# Altium project NodeCardV2.PrjPcb
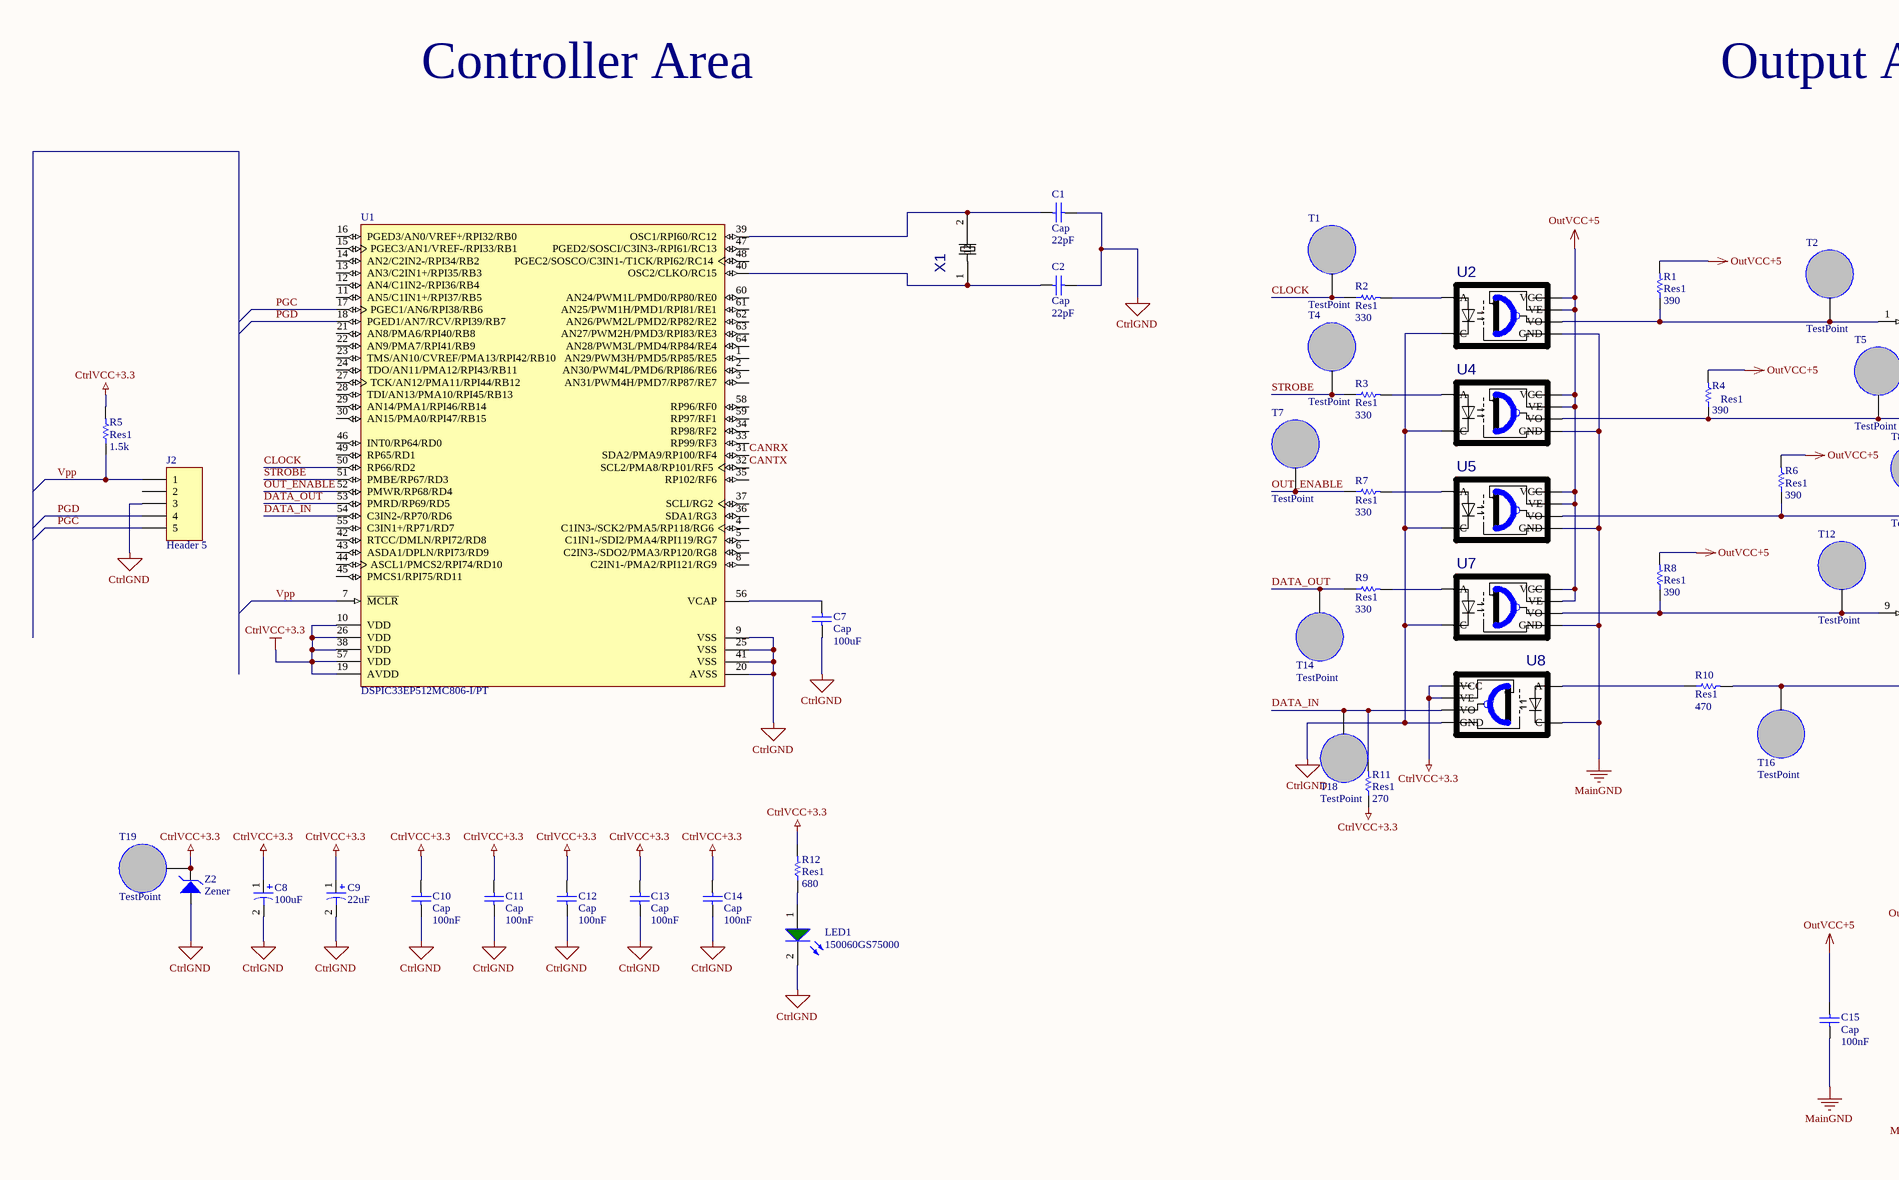
[diagram p0: NodeCardWithCan.SchDoc, top left]
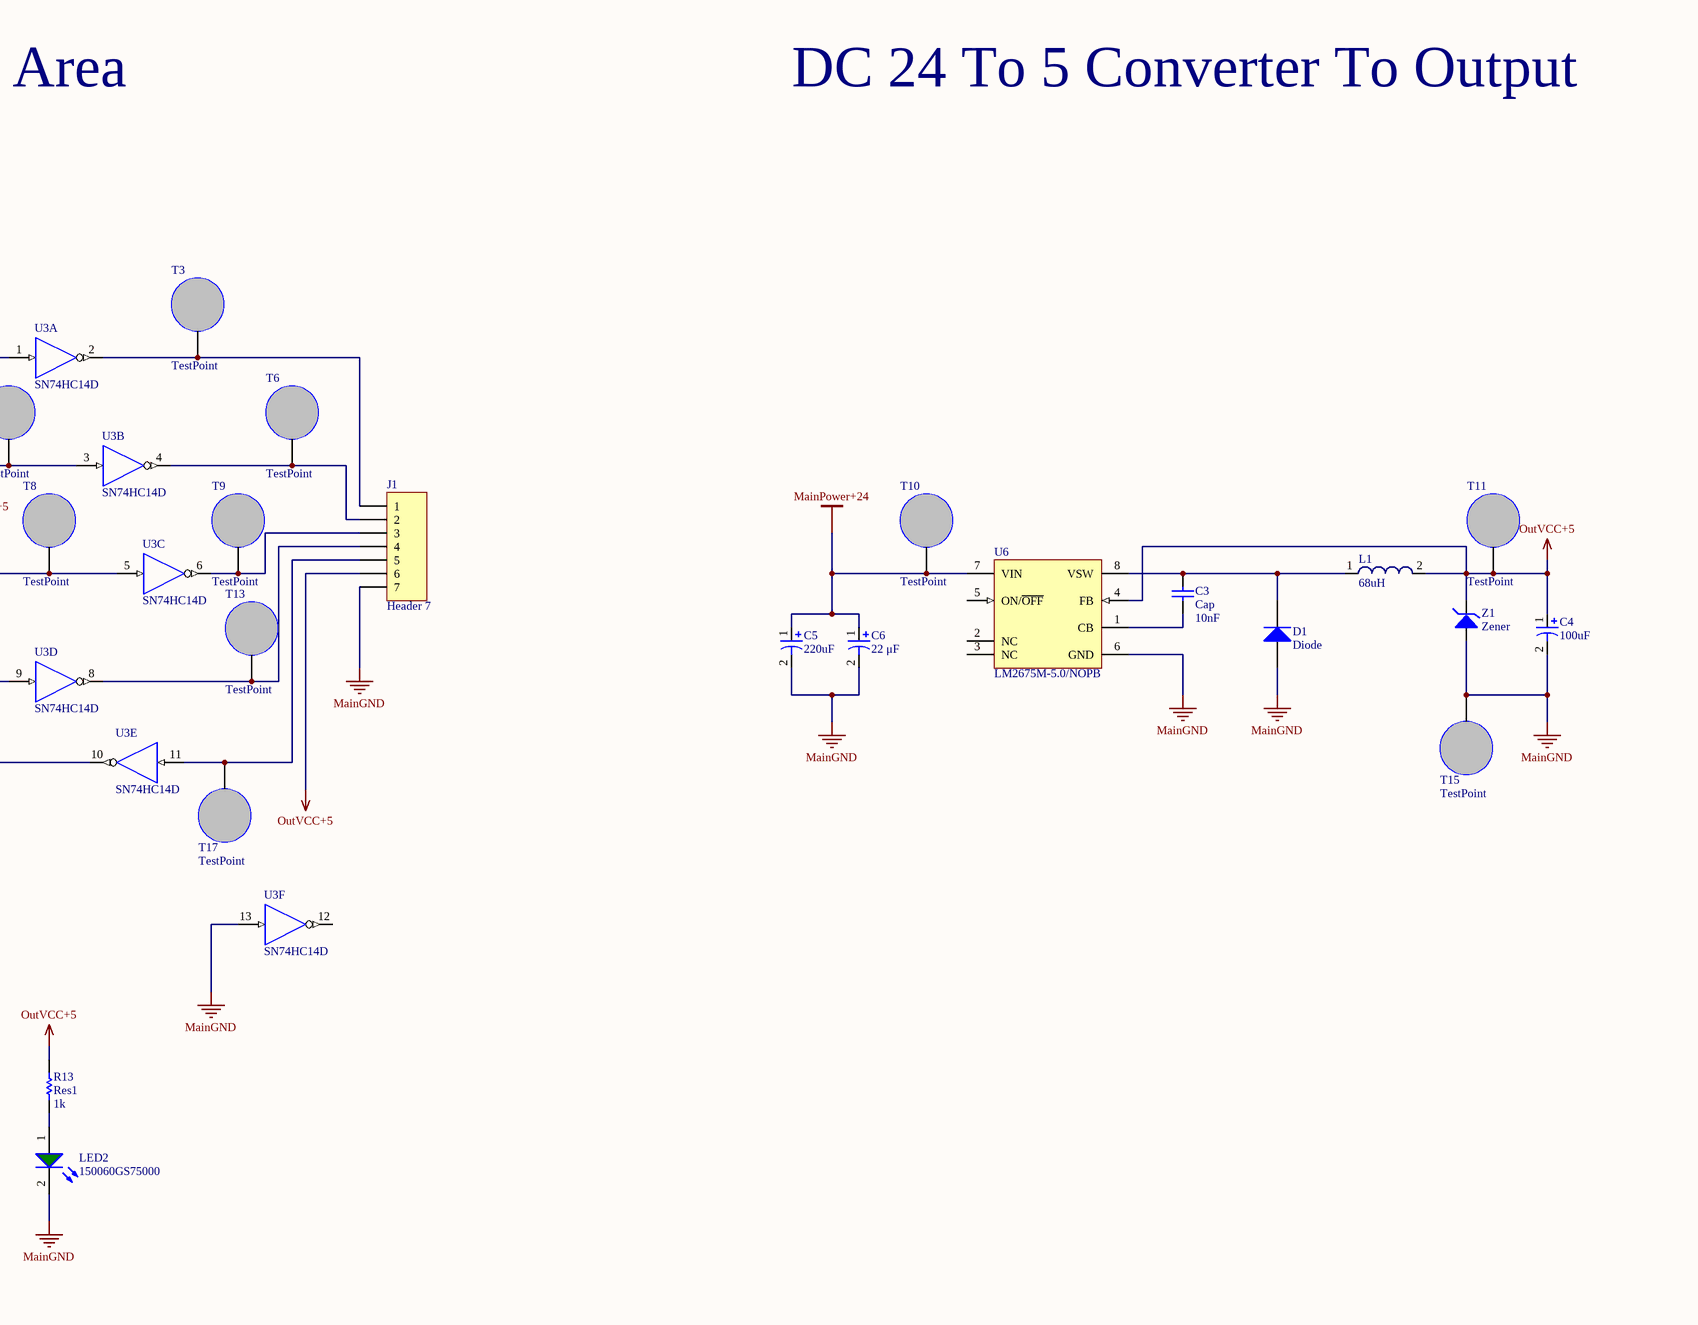
[diagram p1: NodeCardWithCan.SchDoc, top right]
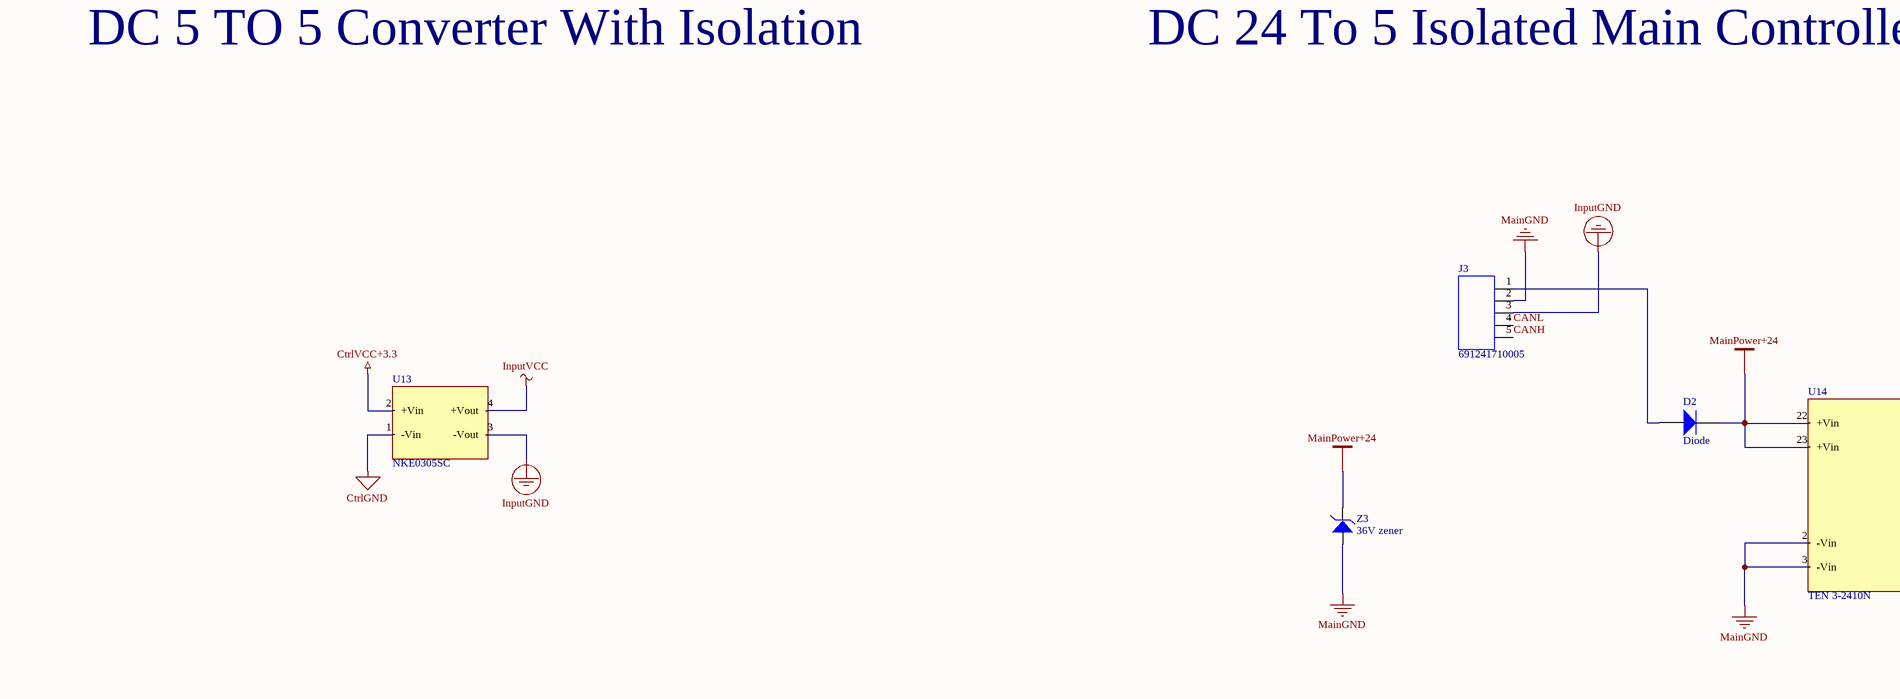
[diagram p2: NodeCardWithCan.SchDoc, bottom left]
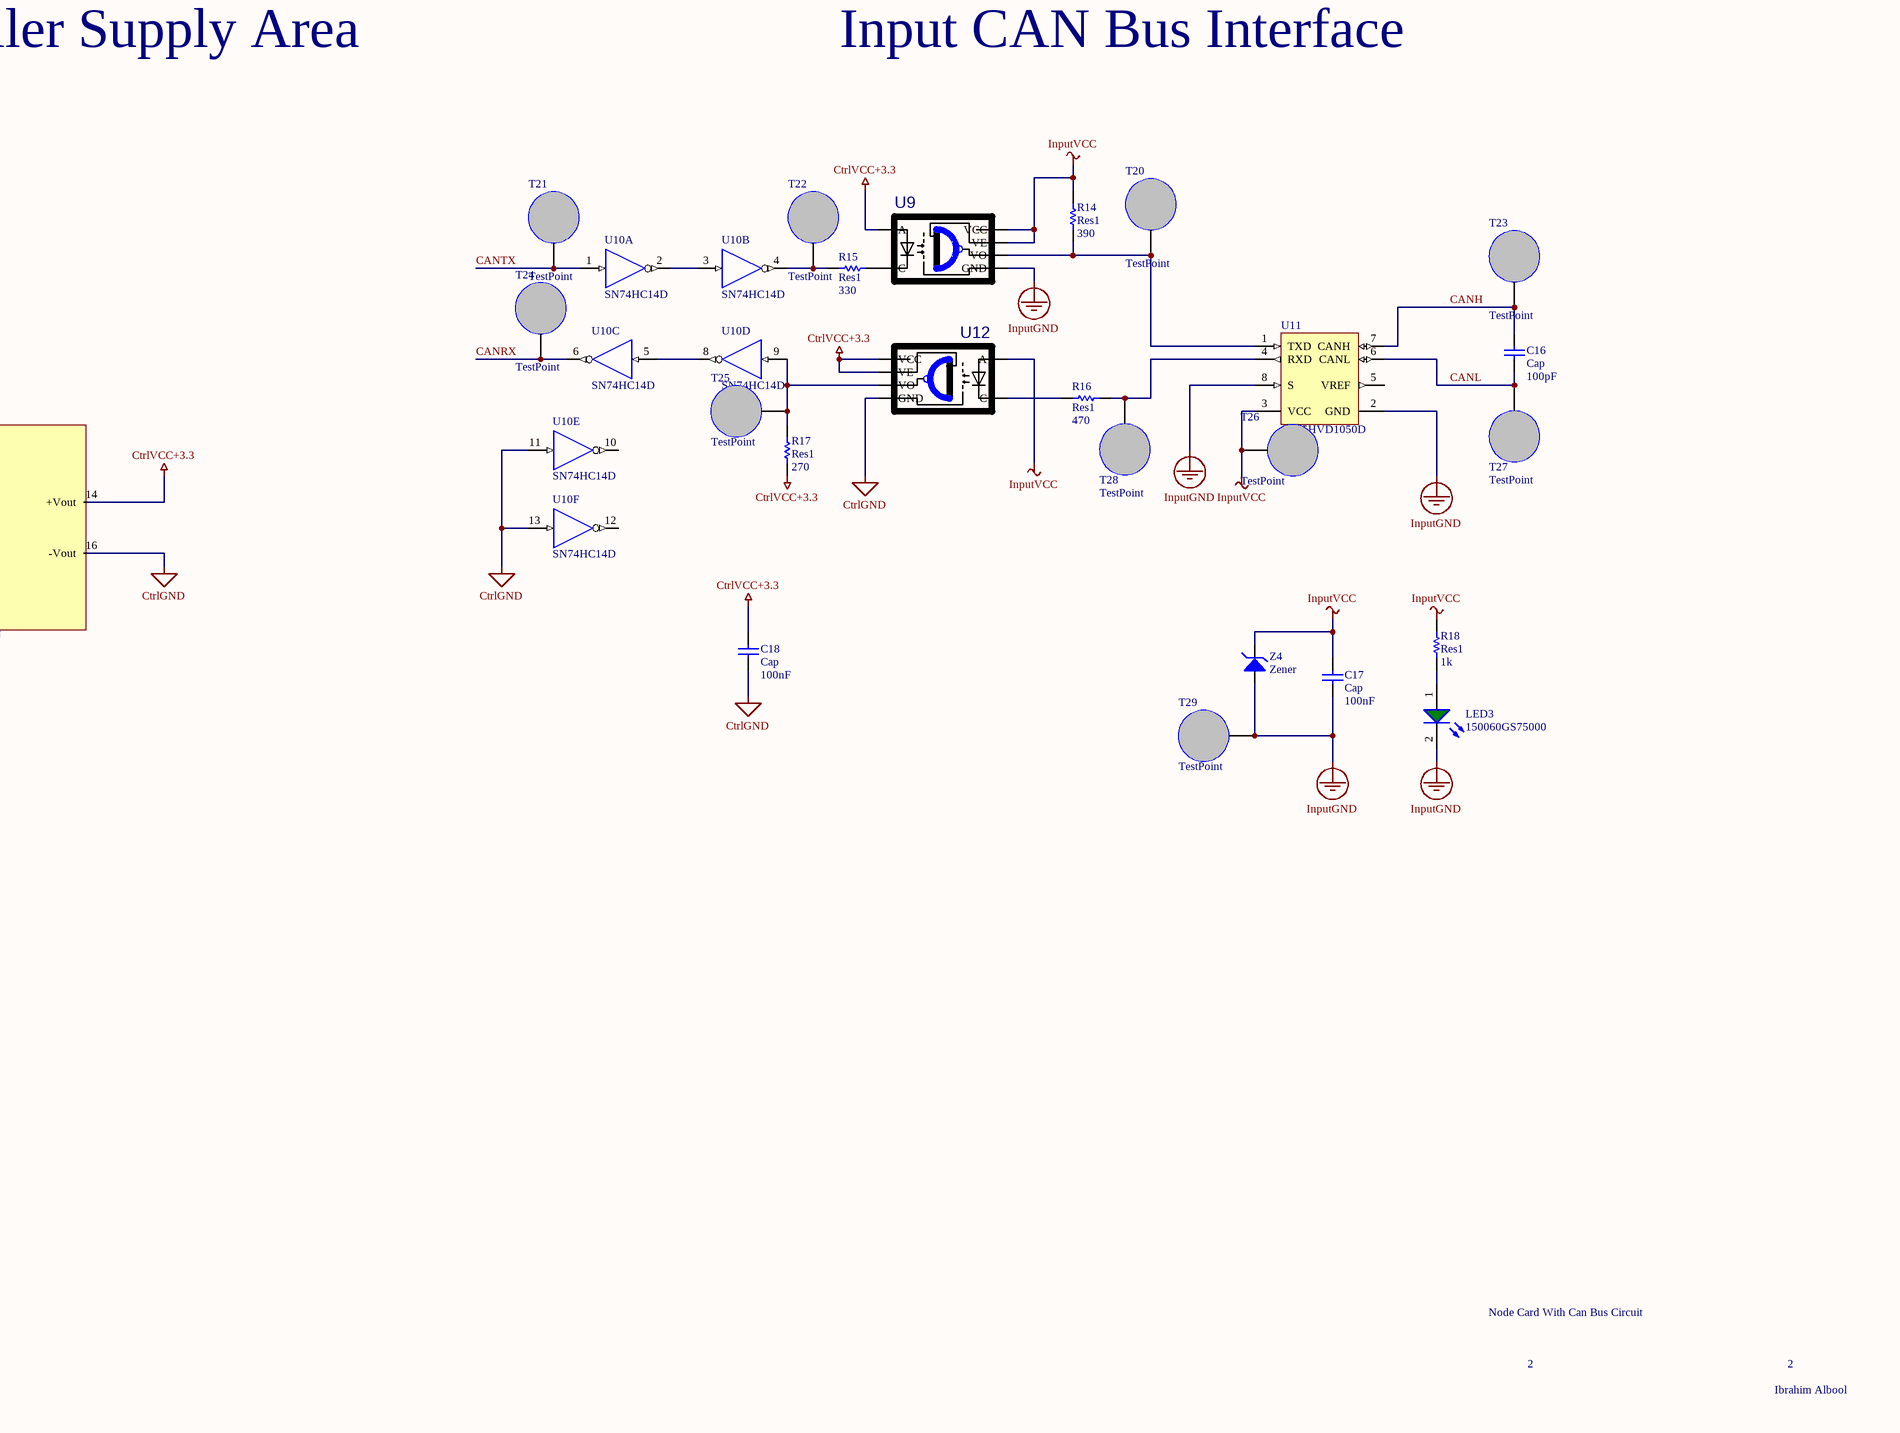
[diagram p3: NodeCardWithCan.SchDoc, bottom right]
1 sheet, 93 parts. Net scope: global (net labels, ports and power ports of the same name join across sheets).
Board file: NodeCardWithCanThick.PcbDoc

## Sheet NodeCardWithCan.SchDoc
size A1

### Parts
C1  Cap  value 22pF  [C0805]
C2  Cap  value 22pF  [C0805]
C3  Cap  value 10nF  [C0805]
C4  100uF  [WCAP-PSLP 6.3x5.8x2.2]
C5  220uF  [WCAP-PTG5 10x12.5x5x0.6]
C6  22 μF  [WCAP-PSLP 6.3x5.8x2.2]
C7  Cap  value 100uF  [C1206]
C8  100uF  [WCAP-PSLP 6.3x5.8x2.2]
C9  22uF  [WCAP-PSLP 4x5.5x1]
C10  Cap  value 100nF  [1608[0603]]
C11  Cap  value 100nF  [1608[0603]]
C12  Cap  value 100nF  [1608[0603]]
C13  Cap  value 100nF  [1608[0603]]
C14  Cap  value 100nF  [1608[0603]]
C15  Cap  value 100nF  [1608[0603]]
C16  Cap  value 100pF  [C0805]
C17  Cap  value 100nF  [1608[0603]]
C18  Cap  value 100nF  [1608[0603]]
D1  Diode  [DO-214AB_Unidirectional]
D2  Diode  [DO-214AB_Unidirectional]
J1  Header 7  [HDR1X7]
J2  Header 5  [HDR1X5]
J3  691241710005  [691241710005]
L1  68uH  [WE-PD 1030]
LED1  150060GS75000  [LED_0603_Green]
LED2  150060GS75000  [LED_0603_Green]
LED3  150060GS75000  [LED_0603_Green]
R1  Res1  value 390  [6-0805_L]
R2  Res1  value 330  [6-0805_L]
R3  Res1  value 330  [6-0805_L]
R4  Res1  value 390  [6-0805_L]
R5  Res1  value 1.5k  [6-0805_L]
R6  Res1  value 390  [6-0805_L]
R7  Res1  value 330  [6-0805_L]
R8  Res1  value 390  [6-0805_L]
R9  Res1  value 330  [6-0805_L]
R10  Res1  value 470  [6-0805_L]
R11  Res1  value 270  [6-0805_L]
R12  Res1  value 680  [6-0805_L]
R13  Res1  value 1k  [6-0805_L]
R14  Res1  value 390  [6-0805_L]
R15  Res1  value 330  [6-0805_L]
R16  Res1  value 470  [6-0805_L]
R17  Res1  value 270  [6-0805_L]
R18  Res1  value 1k  [6-0805_L]
T1  TestPoint  [Test Point]
T2  TestPoint  [Test Point]
T3  TestPoint  [Test Point]
T4  TestPoint  [Test Point]
T5  TestPoint  [Test Point]
T6  TestPoint  [Test Point]
T7  TestPoint  [Test Point]
T8  TestPoint  [Test Point]
T9  TestPoint  [Test Point]
T10  TestPoint  [Test Point]
T11  TestPoint  [Test Point]
T12  TestPoint  [Test Point]
T13  TestPoint  [Test Point]
T14  TestPoint  [Test Point]
T15  TestPoint  [Test Point]
T16  TestPoint  [Test Point]
T17  TestPoint  [Test Point]
T18  TestPoint  [Test Point]
T19  TestPoint  [Test Point]
T20  TestPoint  [Test Point]
T21  TestPoint  [Test Point]
T22  TestPoint  [Test Point]
T23  TestPoint  [Test Point]
T24  TestPoint  [Test Point]
T25  TestPoint  [Test Point]
T26  TestPoint  [Test Point]
T27  TestPoint  [Test Point]
T28  TestPoint  [Test Point]
T29  TestPoint  [Test Point]
U1  DSPIC33EP512MC806-I/PT  [MCHP-TQFP-PT64_N]
U2  HCPL0601  [SOIC08]  (value not drawn)
U3  SN74HC14D  [D014_L]  (parts A,B,C,D,E,F of 6)
U4  HCPL0601  [SOIC08]  (value not drawn)
U5  HCPL0601  [SOIC08]  (value not drawn)
U6  LM2675M-5.0/NOPB  [M08A_N]
U7  HCPL0601  [SOIC08]  (value not drawn)
U8  HCPL0601  [SOIC08]  (value not drawn)
U9  HCPL0601  [SOIC08]  (value not drawn)
U10  SN74HC14D  [D014_N]  (parts A,B,C,D,E,F of 6)
U11  SN65HVD1050D  [D8_L]
U12  HCPL0601  [SOIC08]  (value not drawn)
U13  NKE0305SC  [NKE0305SC]
U14  TEN 3-2410N  [TRACO ISOLATED CONVERTER]
X1  ABLS2-8.000MHZ-D4Y-T  [XTAL1140X470X330]  (value not drawn)
Z1  Zener  [SMB]
Z2  Zener  [SMB]
Z3  36V zener  [DO-214AB_Unidirectional]
Z4  Zener  [SMB]

### Nets
CtrlGND: C1.1 C2.1 C7.1 C8.2 C9.2 C10.1 C11.1 C12.1 C13.1 C14.1 C18.1 J2.3 LED1.2(C) U1.9(VSS) U1.20(AVSS) U1.25(VSS) U1.41(VSS) U2.3(C) U4.3(C) U5.3(C) U7.3(C) U8.5(GND) U10.7(GND) U10.11(A) U10.13(A) U12.5(GND) U13.1(-Vin) U14.16(-Vout) Z2.1
CtrlVCC+3.3: C8.1 C9.1 C10.2 C11.2 C12.2 C13.2 C14.2 C18.2 R5.2 R11.1 R12.2 R17.1 T19.1(TestPoint) U1.10(VDD) U1.19(AVDD) U1.26(VDD) U1.38(VDD) U1.57(VDD) U8.7(VE) U8.8(VCC) U9.2(A) U10.14(VCC) U12.7(VE) U12.8(VCC) U13.2(+Vin) U14.14(+Vout) Z2.2
InputGND: C17.1 J3.3 LED3.2(C) T29.1(TestPoint) U9.5(GND) U11.2(GND) U11.8(S) U13.3(-Vout) Z4.1
InputVCC: C17.2 R14.2 R18.2 T26.1(TestPoint) U9.7(VE) U9.8(VCC) U11.3(VCC) U12.2(A) U13.4(+Vout) Z4.2
MainGND: C4.2 C5.2 C6.2 C15.1 D1.2(A) J1.7 J3.2 LED2.2(C) T15.1(TestPoint) U2.5(GND) U3.7(GND) U3.13(A) U4.5(GND) U5.5(GND) U6.6(GND) U7.5(GND) U8.3(C) U14.2(-Vin) U14.3(-Vin) Z1.1 Z3.2
MainPower+24: C5.1 C6.1 D2.1(K) T10.1(TestPoint) U6.7(VIN) U14.22(+Vin) U14.23(+Vin) Z3.1
OutVCC+5: C4.1 C15.2 J1.6 L1.2 R1.2 R4.2 R6.2 R8.2 R13.2 T11.1(TestPoint) U2.7(VE) U2.8(VCC) U3.14(VCC) U4.7(VE) U4.8(VCC) U5.7(VE) U5.8(VCC) U6.4(FB) U7.7(VE) U7.8(VCC) Z1.2
CANH: C16.2 J3.5 T23.1(TestPoint) U11.7(CANH)
CANL: C16.1 J3.4 T27.1(TestPoint) U11.6(CANL)
CANRX: T24.1(TestPoint) U1.31(SDA2/PMA9/RP100/RF4) U10.6(Y)
CANTX: T21.1(TestPoint) U1.32(SCL2/PMA8/RP101/RF5) U10.1(A)
CLOCK: R2.1 T1.1(TestPoint) U1.50(RP66/RD2)
DATA_IN: R11.2 T18.1(TestPoint) U1.54(C3IN2-/RP70/RD6) U8.6(VO)
DATA_OUT: R9.1 T14.1(TestPoint) U1.53(PMRD/RP69/RD5)
OUT_ENABLE: R7.1 T7.1(TestPoint) U1.52(PMWR/RP68/RD4)
PGC: J2.5 U1.17(PGEC1/AN6/RPI38/RB6)
PGD: J2.4 U1.18(PGED1/AN7/RCV/RPI39/RB7)
STROBE: R3.1 T4.1(TestPoint) U1.51(PMBE/RP67/RD3)
Vpp: J2.1 R5.1 U1.7(~{MCLR})
NetC1_2: C1.2 U1.39(OSC1/RPI60/RC12) X1.2
NetC2_2: C2.2 U1.40(OSC2/CLKO/RC15) X1.1
NetC3_1: C3.1 U6.1(CB)
NetC3_2: C3.2 D1.1(K) L1.1 U6.8(VSW)
NetC7_2: C7.2 U1.56(VCAP)
NetD2_2: D2.2(A) J3.1
NetJ1_1: J1.1 T3.1(TestPoint) U3.2(Y)
NetJ1_2: J1.2 T6.1(TestPoint) U3.4(Y)
NetJ1_3: J1.3 T9.1(TestPoint) U3.6(Y)
NetJ1_4: J1.4 T13.1(TestPoint) U3.8(Y)
NetJ1_5: J1.5 T17.1(TestPoint) U3.11(A)
NetLED1_1: LED1.1(A) R12.1
NetLED2_1: LED2.1(A) R13.1
NetLED3_1: LED3.1(A) R18.1
NetR1_1: R1.1 T2.1(TestPoint) U2.6(VO) U3.1(A)
NetR2_2: R2.2 U2.2(A)
NetR3_2: R3.2 U4.2(A)
NetR4_1: R4.1 T5.1(TestPoint) U3.3(A) U4.6(VO)
NetR6_1: R6.1 T8.1(TestPoint) U3.5(A) U5.6(VO)
NetR7_2: R7.2 U5.2(A)
NetR8_1: R8.1 T12.1(TestPoint) U3.9(A) U7.6(VO)
NetR9_2: R9.2 U7.2(A)
NetR10_1: R10.1 U8.2(A)
NetR10_2: R10.2 T16.1(TestPoint) U3.10(Y)
NetR14_1: R14.1 T20.1(TestPoint) U9.6(VO) U11.1(TXD)
NetR15_1: R15.1 T22.1(TestPoint) U10.4(Y)
NetR15_2: R15.2 U9.3(C)
NetR16_1: R16.1 U12.3(C)
NetR16_2: R16.2 T28.1(TestPoint) U11.4(RXD)
NetR17_2: R17.2 T25.1(TestPoint) U10.9(A) U12.6(VO)
NetU10_2: U10.2(Y) U10.3(A)
NetU10_5: U10.5(A) U10.8(Y)

Not connected (* = marked no-connect by the designer): J2 2; U1 1(AN29/PWM3H/PMD5/RP85/RE5) 2(AN30/PWM4L/PMD6/RPI86/RE6) 3(AN31/PWM4H/PMD7/RP87/RE7) 4(C1IN3-/SCK2/PMA5/RP118/RG6) 5(C1IN1-/SDI2/PMA4/RPI119/RG7) 6(C2IN3-/SDO2/PMA3/RP120/RG8) 8(C2IN1-/PMA2/RPI121/RG9) 11(AN5/C1IN1+/RPI37/RB5) 12(AN4/C1IN2-/RPI36/RB4) 13(AN3/C2IN1+/RPI35/RB3) 14(AN2/C2IN2-/RPI34/RB2) 15(PGEC3/AN1/VREF-/RPI33/RB1) 16(PGED3/AN0/VREF+/RPI32/RB0) 21(AN8/PMA6/RPI40/RB8) 22(AN9/PMA7/RPI41/RB9) 23(TMS/AN10/CVREF/PMA13/RPI42/RB10) 24(TDO/AN11/PMA12/RPI43/RB11) 27(TCK/AN12/PMA11/RPI44/RB12) 28(TDI/AN13/PMA10/RPI45/RB13) 29(AN14/PMA1/RPI46/RB14) 30(AN15/PMA0/RPI47/RB15) 33(RP99/RF3) 34(RP98/RF2) 35(RP102/RF6) 36(SDA1/RG3) 37(SCLI/RG2) 42(RTCC/DMLN/RPI72/RD8) 43(ASDA1/DPLN/RPI73/RD9) 44(ASCL1/PMCS2/RPI74/RD10) 45(PMCS1/RPI75/RD11) 46(INT0/RP64/RD0) 47(PGED2/SOSCI/C3IN3-/RPI61/RC13) 48(PGEC2/SOSCO/C3IN1-/T1CK/RPI62/RC14) 49(RP65/RD1) 55(C3IN1+/RP71/RD7) 58(RP96/RF0) 59(RP97/RF1) 60(AN24/PWM1L/PMD0/RP80/RE0) 61(AN25/PWM1H/PMD1/RPI81/RE1) 62(AN26/PWM2L/PMD2/RP82/RE2) 63(AN27/PWM2H/PMD3/RPI83/RE3) 64(AN28/PWM3L/PMD4/RP84/RE4); U3 12(Y); U6 2(NC) 3(NC) 5(ON/~{OFF}); U10 10(Y) 12(Y); U11 5(VREF); U14 9(NC) 11(NC)

### Notes on the sheet
- Controller Area
- Output Area
- DC 24 To 5 Converter To Output
- DC 5 TO 5 Converter With Isolation
- DC 24 To 5 Isolated Main Controller Supply Area
- Input CAN Bus Interface
- Node Card With Can Bus Circuit
- 2
- Ibrahim Albool

### Library data of the parts
C1-C3 C7 C10-C18 = Cap: Capacitor; Published: 8-Jun-2000; LatestRevisionDate: 17-Jul-2002; LatestRevisionNote: Re-released for DXP Platform.; PackageReference: RAD-0.3; Publisher: Altium Limited; PackageDescription: Radial Cap, Thru-Hole; 2 Leads; 0.3 in Pin Spacing
C4 = WCAP-PSLP 6.3x5.8x2.2 875105544003: WCAP-PSLP Aluminum Polymer Capacitors , 22 μF; + / - 20%; 16 V , 6,3 x 5,8; Manufacturer: Wurth Elektronik; E-mail: libraries@we-online.com; Capacitance: 22 μF; Characteristics: Aluminum Polymer Capacitors;Recommended soldering: Reflow;Operating temperature: –55 °C to +105 °C;Low profile SMD product series;Low ESR at high frequency range;High permissible ripple current;Load life: 2000 h @ +105 °C; ComponentLink1Description: Manufacturer; ComponentLink1URL: http://www.we-online.com; ComponentLink2Description: Datasheet; ComponentLink2URL: http://katalog.we-online.de/pbs/datasheet/875105544003.pdf; Created by: Karrer Zheng; Created Date: 5/13/2015; Application: Low voltage port filtering, appplid to high-end switching power supply, PC(desktop,laptop ),industrial computer, VGA card, server power, charger, TV, digital set-top box,DC-DC power module, game machine etc which consume large current with high speed circuit.; partNo: 875105544003
C5 = WCAP-PTG5 10x12.5x5x0.6 870025175010: WCAP-PTG5 Aluminum Polymer Capacitors , 1000 μF; + / - 20%; 6,3 V , 10 x 12,5; Manufacturer: Wurth Elektronik; E-mail: libraries@we-online.com; Capacitance: 1000 μF; Characteristics: Aluminum Polymer Capacitors; Recommended soldering: Wave ;Operating temperature: –55 °C to +105 °C ; Low ESR at high frequency range; High permissible ripple current; Long life: 2000 h @ +105 °C; ComponentLink1Description: Manufacturer; ComponentLink1URL: http://www.we-online.com; ComponentLink2Description: Datasheet; ComponentLink2URL: http://katalog.we-online.de/pbs/datasheet/870025175010.pdf; Created by: Karrer Zheng; Created Date: 5/13/2015; Application: Low voltage port filtering, appplid to high-end switching power supply, PC(desktop,laptop ),industrial computer, VGA card, server power, charger, TV, digital set-top box,DC-DC power module, game machine etc which consume large current with high speed circuit.; partNo: 870025175010
C6 = WCAP-PSLP 6.3x5.8x2.2 875105544003: WCAP-PSLP Aluminum Polymer Capacitors , 22 μF; + / - 20%; 50 V , 6,3 x 5,8; Manufacturer: Wurth Elektronik; E-mail: libraries@we-online.com; Characteristics: Aluminum Polymer Capacitors;Recommended soldering: Reflow;Operating temperature: –55 °C to +105 °C;Low profile SMD product series;Low ESR at high frequency range;High permissible ripple current;Load life: 2000 h @ +105 °C; ComponentLink1Description: Manufacturer; ComponentLink1URL: http://www.we-online.com; ComponentLink2Description: Datasheet; ComponentLink2URL: http://katalog.we-online.de/pbs/datasheet/875105544003.pdf; Created by: Karrer Zheng; Created Date: 5/13/2015; Capacitance: 22 μF; Application: Low voltage port filtering, appplid to high-end switching power supply, PC(desktop,laptop ),industrial computer, VGA card, server power, charger, TV, digital set-top box,DC-DC power module, game machine etc which consume large current with high speed circuit.; partNo: 875105544003
C8 = WCAP-PSLP 6.3x5.8x2.2 875105544003: WCAP-PSLP Aluminum Polymer Capacitors , 22 μF; + / - 20%; 16V , 6,3 x 5,8; Manufacturer: Wurth Elektronik; E-mail: libraries@we-online.com; Capacitance: 22 μF; Characteristics: Aluminum Polymer Capacitors;Recommended soldering: Reflow;Operating temperature: –55 °C to +105 °C;Low profile SMD product series;Low ESR at high frequency range;High permissible ripple current;Load life: 2000 h @ +105 °C; ComponentLink1Description: Manufacturer; ComponentLink1URL: http://www.we-online.com; ComponentLink2Description: Datasheet; ComponentLink2URL: http://katalog.we-online.de/pbs/datasheet/875105544003.pdf; Created by: Karrer Zheng; Created Date: 5/13/2015; Application: Low voltage port filtering, appplid to high-end switching power supply, PC(desktop,laptop ),industrial computer, VGA card, server power, charger, TV, digital set-top box,DC-DC power module, game machine etc which consume large current with high speed circuit.; partNo: 875105544003
C9 = WCAP-PSLP 4x5.5x1 875105240001: WCAP-PSLP Aluminum Polymer Capacitors , 10 μF; + / - 20%; 10 V , 4 x 5,5; Manufacturer: Wurth Elektronik; E-mail: libraries@we-online.com; Capacitance: 10 μF; Characteristics: Aluminum Polymer Capacitors;Recommended soldering: Reflow;Operating temperature: –55 °C to +105 °C;Low profile SMD product series;Low ESR at high frequency range;High permissible ripple current;Load life: 2000 h @ +105 °C; ComponentLink1Description: Manufacturer; ComponentLink1URL: http://www.we-online.com; ComponentLink2Description: Datasheet; ComponentLink2URL: http://katalog.we-online.de/pbs/datasheet/875105240001.pdf; Created by: Karrer Zheng; Created Date: 5/13/2015; Application: Low voltage port filtering, appplid to high-end switching power supply, PC(desktop,laptop ),industrial computer, VGA card, server power, charger, TV, digital set-top box,DC-DC power module, game machine etc which consume large current with high speed circuit.; partNo: 875105240001
D1 D2 = Diode: Default Diode; Published: 8-Jun-2000; LatestRevisionDate: 17-Jul-2002; LatestRevisionNote: Re-released for DXP Platform.; PackageVersion: Sep-1996; PackageReference: SMC; Publisher: Altium Limited; PackageDescription: DO-214-AB/SMC; 2 C-Bend Leads; Body 7.9 x 5.9 mm, inc. leads (LxW); Code_JEDEC: DO-214-AB
J1 = Header 7: Header, 7-Pin; LatestRevisionDate: 17-Jul-2002; LatestRevisionNote: Re-released for DXP Platform.; Publisher: Altium Limited
J2 = Header 5: Header, 5-Pin; LatestRevisionDate: 17-Jul-2002; LatestRevisionNote: Re-released for DXP Platform.; Publisher: Altium Limited
J3 = 691241710005: WR-TBL Horizontal Cable Entry With Rising Cage Clamp,Serie 2417 - 5.00 mm; Manufacturer: Wurth Elektronik; ComponentLink1 Description: Manufacturer; ComponentLink2 Description: Datasheet; ComponentLink1URL: http://www.we-online.de; ComponentLink2URL: http://katalog.we-online.de/em/datasheet/6912417100XX.pdf; Created by: Baojun Chen; Created Date: 8.Sep.2015; partNo: 691241710005
L1 = WE-PD 1030, 7447713015: SMD-Shielded Power Inductor WE-PD, L=1.50 µH; Manufacturer: Würth Elektronik eiSos GmbH; Inductance: 1.50 µH; partNo: 7447713015; ComponentLink1Description: Manufacturer; ComponentLink1URL: http://www.we-online.de; Created by: Christin Otto; Created Date: March 2013; ComponentLink2Description: Datasheet; ComponentLink2URL: http://www.we-online.de/katalog/media/pdf/7447713015.pdf
LED1-LED3 = WL-SMCW 0603  150060GS75000: SMD mono-color Chip LED, WL-SMCW, Green; Manufacturer: W黵th Elektronik eiSos GmbH; PartNo: 150060GS75000; ComponentLink1Description: Manufacturer; ComponentLink1URL: http://www.we-online.de; Created by: Christin Otto; Created Date: June 2013; ComponentLink2Description: Datasheet; ComponentLink2URL: http://katalog.we-online.com/led/datasheet/150060GS75000.pdf; Color: Green
R1-R18 = Res1: Resistor; Published: 8-Jun-2000; LatestRevisionDate: 17-Jul-2002; LatestRevisionNote: Re-released for DXP Platform.; PackageReference: AXIAL-0.3; Publisher: Altium Limited; PackageDescription: Axial Device, Thru-Hole; 2 Leads; 0.3 in Pin Spacing
T1-T29 = Test Point
U1 = DSPIC33EP512MC806-I/PT: 16-Bit Microcontroller and Digital Signal Controller with High-Speed PWM, USB and Advanced Analog, 70 MIPS, 53 I/O, EPMP, -40 to 85 degC, 64-pin TQFP (PT64), Tray; Manufacturer: Microchip; DatasheetVersion: Rev. G; PackageVersion: C04-085B; PackageReference: TQFP-PT64; PackageDescription: 64-Lead Plastic Thin Quad FlatPack, 10 x 10 mm Body, 0.5 mm Pitch; Supplier 1: Digi-Key; Supplier Part Number 1: DSPIC33EP512MC806-I/PT-ND; Supplier 2: Newark; Supplier Part Number 2: 72T9319; Supplier 3: Mouser; Supplier Part Number 3: 579-33EP512MC806IPT; Mounting Technology: Surface Mount; PartNumber: DSPIC33EP512MC806-I/PT; ComponentLink1Description: Manufacturer URL; ComponentLink1URL: http://www.microchip.com; ComponentLink2Description: Datasheet; ComponentLink2URL: http://ww1.microchip.com/downloads/en/DeviceDoc/70616g.pdf; ComponentLink3Description: Package Specification; ComponentLink3URL: http://www.microchip.com/stellent/groups/techpub_sg/documents/packagingspec/en012702.pdf; ComponentLink4Description: Product URL; ComponentLink4URL: http://www.microchip.com/dsPIC33EP512MC806
U3 U10 = SN74HC14D: Hex Schmitt-Trigger Inverter; Published: 8-Jun-2000; LatestRevisionDate: 13-Apr-2006; LatestRevisionNote: IPC-7351 Footprint Added.; DatasheetVersion: May-1997; PackageVersion: Jan-1998; PackageReference: D014; Publisher: Altium Limited; PackageDescription: 14-Pin Small Outline Integrated Circuit 1.27 mm Pitch; Code_IPC: SOIC127P600-14; ComponentLink1Description: Manufacturer Link; ComponentLink1URL: http://www.ti.com/; ComponentLink2Description: Datasheet; ComponentLink2URL: http://www-s.ti.com/sc/ds/sn74hc14.pdf
U6 = LM2675M-5.0/NOPB: SIMPLE SWITCHER® Power Converter High Efficiency 1A Step-Down Voltage Regulator, 8-pin Narrow SOIC, Pb-Free; Manufacturer: National Semiconductor; PackageTopMarking: NSZXTT*2675*M5.0; PowerWise: N; High-Reliability: Y; DatasheetVersion: Jun-2005; PackageVersion: revM, May-2009; PackageReference: M08A; PackageDescription: SOIC Narrow, 4.9 x 3.9 x 1.45mm, 8 Lead, 1.27mm Pitch; PartNumber: LM2675M-5.0/NOPB; RoHS: Y; PinCount: 8; CompType: Switcher; Code_JEDEC: MS-012-AA; Code_IPC: SOIC127P600-8; ComponentLink1Description: Manufacturer URL; ComponentLink1URL: http://www.national.com/; ComponentLink2Description: LM2675 Datasheet; ComponentLink2URL: http://www.national.com/ds/LM/LM2675.pdf; ComponentLink3Description: LM2675 Web Page; ComponentLink3URL: http://www.national.com/pf/LM/LM2675.html; ComponentLink4Description: M08A Package Page; ComponentLink4URL: http://www.national.com/packaging/folders/m08a.html
U11 = SN65HVD1050D: High-Speed EMC Optimized CAN Transceiver, 70 mA, 5 V, -40 to 125 degC, 8-pin SOIC (D), Green (RoHS & no Sb/Br); Manufacturer: Texas Instruments; Drivers Per Package: 1; Bus Fault Voltage(V): -4 to 16; Transient Pulse Protection(V): -200 to 200; ICC(Max)(mA): 70; Supply Voltage(s)(V): 5; Rating: Catalog; DatasheetVersion: SLLS632B; PackageVersion: revM, Jun-2011; PackageReference: D8; PackageDescription: 8-Pin Plastic Small Outline Integrated Circuit, 4.9 x 3.9 mm, Pitch 1.27 mm Pitch; Supplier 1: Digi-Key; Supplier Part Number 1: 296-19416-5-ND; Supplier 2: Farnell; Supplier Part Number 2: 1220984; Supplier 3: Newark; Supplier Part Number 3: 70K4439; Supplier 4: Mouser; Supplier Part Number 4: 595-SN65HVD1050D; Eco-Plan: Green (RoHS & no Sb/Br); SubFamily: CAN; Receivers Per Package: 1; Isolated: No; Footprint: TJA1050; Mounting Technology: Surface Mount; PartNumber: SN65HVD1050D; Code_JEDEC: MS-012AA; ComponentLink1Description: Datasheet; ComponentLink1URL: http://www.ti.com/general/docs/lit/getliterature.tsp?genericPartNumber=SN65HVD1050&fileType=pdf
U13 = NKE0305SC: muRata 3.3 to 5.0 isolated converter
U14 = TEN 3-2410N: Traco 24/3.3 isolated converter
Z1-Z4 = WE-TVSP DO-214AB, 824540102: WE-TVSP Power TVS Diode, Unidirectional, 1500 W, 100 VDC; Manufacturer: Wurth Elektronik; partNo: 824540102; ComponentLink1Description: Manufacturer; ComponentLink1URL: http://www.we-online.de; Created by: Baojun Chen; Created Date: Nov.2015; ComponentLink2Description: Datasheet; ComponentLink2URL: http://katalog.we-online.de/pbs/datasheet/824540102.pdf
U2 U4 U5 U7-U9 U12 = HCPL0601: Value: *
X1 = ABLS2-8.000MHZ-D4Y-T: Value: *